# EAGLE design esp_console (EAGLE 9.2.1)
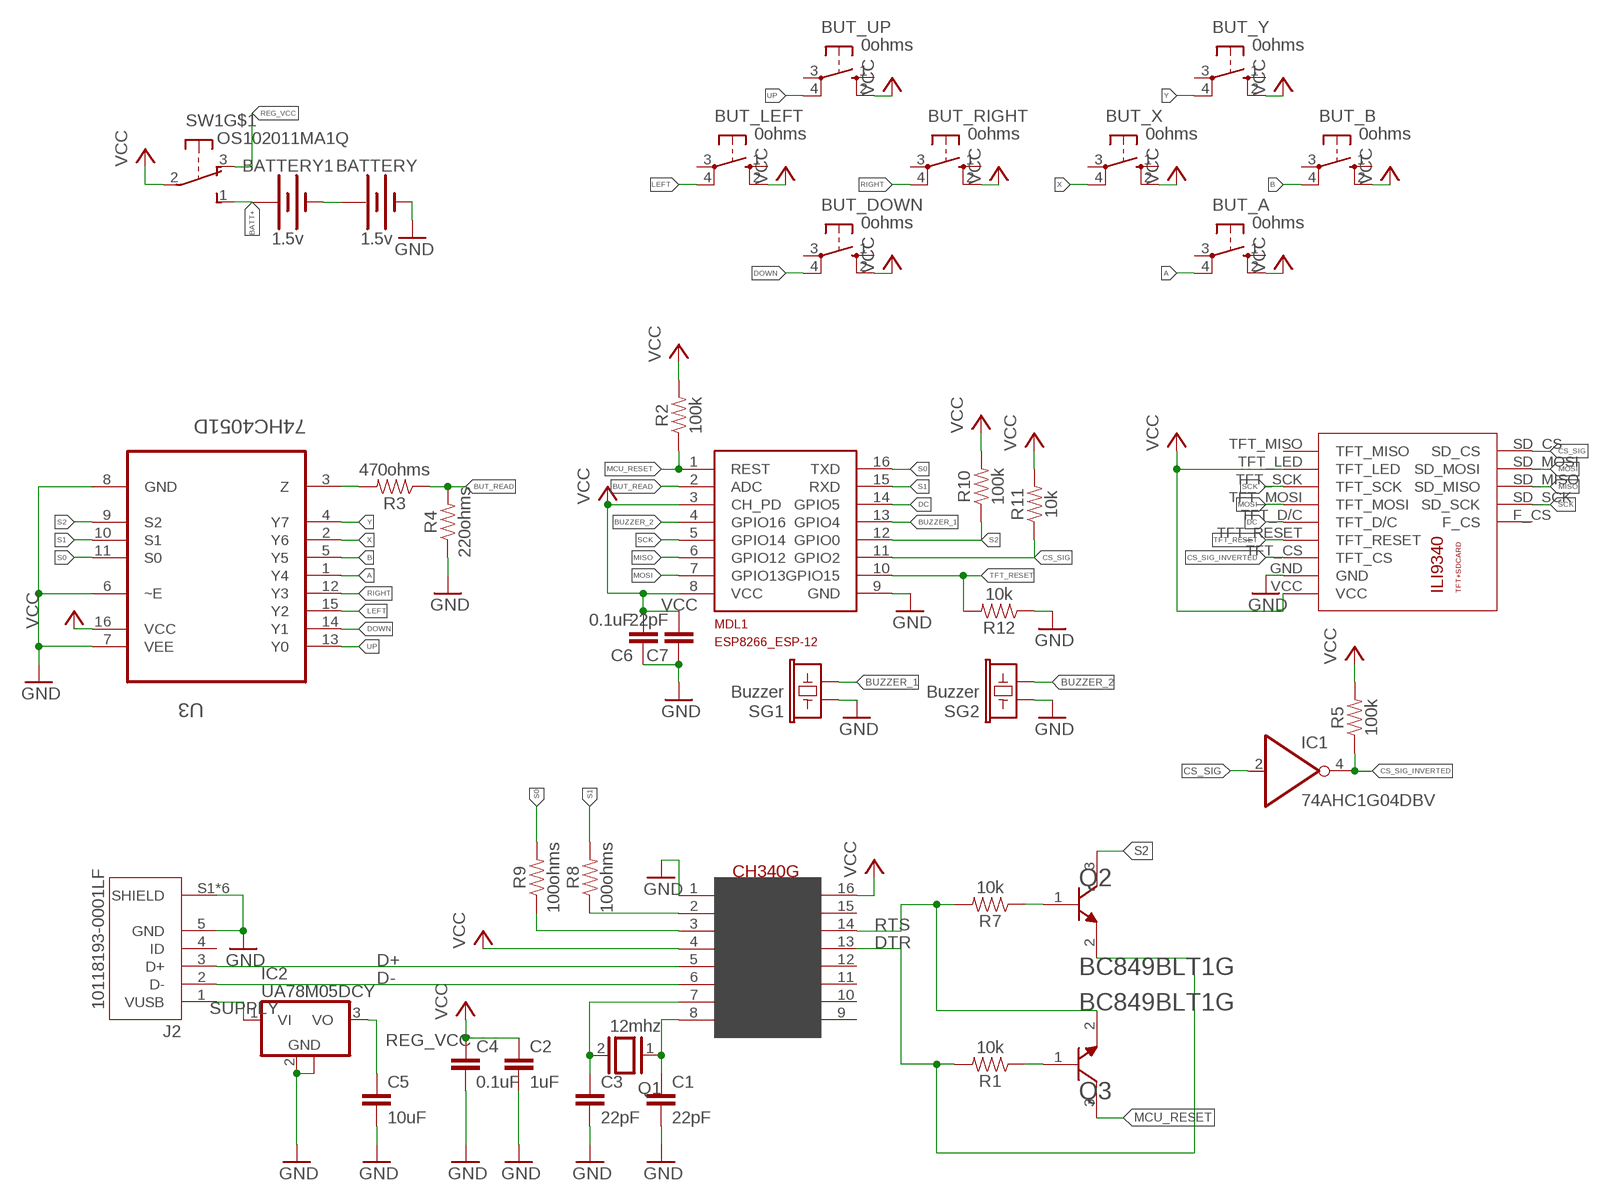
[diagram p0: schematic, sheet 1]

## Parts
BATTERY  1.5v  BATTERY-AA  [BATTERY-AA]
BATTERY1  1.5v  BATTERY-AA  [BATTERY-AA]
BUT_A  0ohms  10-XX  [B3F-10XX]
BUT_B  0ohms  10-XX  [B3F-10XX]
BUT_DOWN  0ohms  10-XX  [B3F-10XX]
BUT_LEFT  0ohms  10-XX  [B3F-10XX]
BUT_RIGHT  0ohms  10-XX  [B3F-10XX]
BUT_UP  0ohms  10-XX  [B3F-10XX]
BUT_X  0ohms  10-XX  [B3F-10XX]
BUT_Y  0ohms  10-XX  [B3F-10XX]
C1  22pF  C-EUC0603  [C0603]
C2  1uF  C-EUC0603  [C0603]
C3  22pF  C-EUC0603  [C0603]
C4  0.1uF  C-EUC0603  [C0603]
C5  10uF  C-EUC0603  [C0603]
C6  0.1uF  C-EUC0603  [C0603]
C7  22pF  C-EUC0603  [C0603]
IC1  74AHC1G04DBV  [SOT23-5]
IC2  UA78M05DCY  [SOT223]
J2  10118193-0001LF  [FCI_10118193-0001LF]
MDL1  MCU  ESP8266-12GPIO04/05_CORRECTED  [ESP8266-ESP12]
Q1  12mhz  XTAL/S  [QS]
Q2  ON_SEMICONDUCTOR_BC849BLT1GON_SEMICONDUCTOR_BC849BLT1G_0_0  [ON_SEMICONDUCTOR_BC849BLT1G_0]
Q3  ON_SEMICONDUCTOR_BC849BLT1GON_SEMICONDUCTOR_BC849BLT1G_0_0  [ON_SEMICONDUCTOR_BC849BLT1G_0]
R1  10k  10KOHM-0603-1/10W-1%  [0603]
R2  100k  10KOHM-0603-1/10W-1%  [0603]
R3  470ohms  10KOHM-0603-1/10W-1%  [0603]
R4  220ohms  10KOHM-0603-1/10W-1%  [0603]
R5  100k  10KOHM-0603-1/10W-1%  [0603]
R7  10k  10KOHM-0603-1/10W-1%  [0603]
R8  100ohms  10KOHM-0603-1/10W-1%  [0603]
R9  100ohms  10KOHM-0603-1/10W-1%  [0603]
R10  100k  10KOHM-0603-1/10W-1%  [0603]
R11  10k  10KOHM-0603-1/10W-1%  [0603]
R12  10k  10KOHM-0603-1/10W-1%  [0603]
SG1  Buzzer  BUZZERSMD2  [BUZZER-CCV]
SG2  Buzzer  BUZZERSMD2  [BUZZER-CCV]
SW1  OS102011MA1Q  [OS102011MA1Q]
U3  74HC4051D  [SOIC127P600X175-16N]
U$1  CH340G  [SOIC16]
U$2  ILI9340-5PIN  [ILI9340-5PIN]

## Nets
A: BUT_A.4(P1) U3.1(Y4)
B: BUT_B.4(P1) U3.5(Y5)
BATT+: BATTERY1.PWR@1(+) SW1.1(S)
BATT_LINK: BATTERY1.GND@1(-) BATTERY.PWR@1(+)
BUT_READ: MDL1.2(ADC) R3.1 R4.2
BUT_READ_3V3: R3.2 U3.3(Z)
BUZZER_1: MDL1.13(GPIO4) SG1.-
BUZZER_2: MDL1.4(GPIO16) SG2.-
CRYSTALIN: C3.1 Q1.2 U$1.7(XI)
CRYSTALOUT: C1.1 Q1.1 U$1.8(XO)
CS_SIG: IC1.2(I) MDL1.11(GPIO2) R11.1 U$2.SD_CS
CS_SIG_INVERTED: IC1.4(O) R5.1 U$2.TFT_CS
D+: J2.3(D+) U$1.5(D+)
D-: J2.2(D-) U$1.6(D-)
DC: MDL1.14(GPIO5) U$2.TFT_D/C
DOWN: BUT_DOWN.4(P1) U3.14(Y1)
DTR: Q2.2(E) R1.2 U$1.13(DTR)
GND: BATTERY.GND@1(-) C1.2 C2.2 C3.2 C4.2 C5.2 C6.1 C7.1 IC2.2(GND) IC2.4(GND) J2.5(GND) J2.S1(SHIELD) J2.S2(SHIELD) J2.S3(SHIELD) J2.S4(SHIELD) J2.S5(SHIELD) J2.S6(SHIELD) MDL1.9(GND) R4.1 R12.1 SG1.+ SG2.+ U3.6(~E) U3.7(VEE) U3.8(GND) U$1.1(GND) U$2.GND
LEFT: BUT_LEFT.4(P1) U3.15(Y2)
MCU_RESET: MDL1.1(REST) Q3.3(C) R2.1
MISO: MDL1.6(GPIO12) U$2.SD_MISO
MOSI: MDL1.7(GPIO13) U$2.SD_MOSI U$2.TFT_MOSI
N$3: Q3.1(B) R1.1
N$4: Q2.1(B) R7.1
REG_VCC: C5.1 IC2.3(VO) SW1.3(O)
RIGHT: BUT_RIGHT.4(P1) U3.12(Y3)
RTS: Q3.2(E) R7.2 U$1.14(RTS)
S0: MDL1.16(TXD) R9.2 U3.11(S0)
S1: MDL1.15(RXD) R8.2 U3.10(S1)
S2: MDL1.12(GPIO0) Q2.3(C) R10.1 U3.9(S2)
SCK: MDL1.5(GPIO14) U$2.SD_SCK U$2.TFT_SCK
SUPPLY: IC2.1(VI) J2.1(VUSB)
TFT_RESET: MDL1.10(GPIO15) R12.2 U$2.TFT_RESET
TXFROMMCU: R9.1 U$1.3(RX)
TXFROMPROGRAMMER: R8.1 U$1.2(TX)
UP: BUT_UP.4(P1) U3.13(Y0)
VCC: BUT_A.2(S1) BUT_B.2(S1) BUT_DOWN.2(S1) BUT_LEFT.2(S1) BUT_RIGHT.2(S1) BUT_UP.2(S1) BUT_X.2(S1) BUT_Y.2(S1) C2.1 C4.1 C6.2 C7.2 MDL1.3(CH_PD) MDL1.8(VCC) R2.2 R5.2 R10.2 R11.2 SW1.2(P) U3.16(VCC) U$1.4(V3) U$1.16(VCC) U$2.TFT_LED U$2.VCC
X: BUT_X.4(P1) U3.2(Y6)
Y: BUT_Y.4(P1) U3.4(Y7)
Unconnected: BUT_A.1(S) BUT_A.3(P) BUT_B.1(S) BUT_B.3(P) BUT_DOWN.1(S) BUT_DOWN.3(P) BUT_LEFT.1(S) BUT_LEFT.3(P) BUT_RIGHT.1(S) BUT_RIGHT.3(P) BUT_UP.1(S) BUT_UP.3(P) BUT_X.1(S) BUT_X.3(P) BUT_Y.1(S) BUT_Y.3(P) J2.4(ID) SW1.MT1(MT) SW1.MT2(MT) U$1.9(CTS) U$1.10(DSR) U$1.11(RI) U$1.12(DCD) U$1.15(RS232) U$2.F_CS U$2.TFT_MISO

## Power pins joined to a net without a drawn wire
GND: IC1.3(GND)
VCC: IC1.5(VCC)

## Library data of the parts
BATTERY BATTERY1 = SparkFun-Batteries:BATTERY: Battery - Single Cell A variety of battery chemistries, sizes, and footprints. Device List: 20MM_PTH - Coin Cell Battery Holder - 20mm (PTH) <https://www.sparkfun.com/products/783> 6.8MM_PTH - Coin Cell Battery Holder - 6.8MM(SMD) <https://www.digikey.com/product-detail/en/seiko-instruments/MS621FE-FL11E/728-1057-ND/1889208?WT.srch=1&gclid=CNOQ5a6LzdQCFZS2wAodXCkE0g> 12MM_SMD - Coin Cell Battery Holder - 12mm (SMD) <https://www.sparkfun.com/products/10592> 12MM_PTH - Coin Cell Battery Holder - 12mm (PTH) <https://www.sparkfun.com/products/7948> 20MM_SMD - 20mm Coin Cell Battery Holder (SMD) (2 legs) Used on the Big Time Watch Kit <https://www.sparkfun.com/products/11734> 20MM_SMD_4LEGS - Coin Cell Battery Holder - 20mm (SMD) <https://www.sparkfun.com/products/11892> 20MM_SMD_4LEGS_OVERPASTE - Coin Cell Battery Holder - 20mm (SMD) <https://www.sparkfun.com/products/11892> (Over-paste on the legs) 24.5MM_PTH - Coin Cell Battery Holder - 24.5mm (PTH) <https://www.sparkfun.com/products/8863> 9V - 9V Battery Holder - PC Mount Used on the SparkFun SparkPunk Sound Kit <https://www.sparkfun.com/products/11177> and SparkFun SparkPunk Sequencer Kit <https://www.sparkfun.com/products/12707> 18650 - Battery Holder - 18650 (PTH) <https://www.sparkfun.com/products/13113> AA - Battery Holder - 1xAA (PTH) <https://www.sparkfun.com/products/7949> AAA - Battery Holder - 1xAAA (PTH) <https://www.sparkfun.com/products/12718> AA_KIT - Battery Holder - 1xAA (PTH) <https://www.sparkfun.com/products/7949> Special kit package - pads only have exposed copper on one side of the board. AAA_KIT - Battery Holder - 1xAAA (PTH) <https://www.sparkfun.com/products/12718> Special kit package - pads only have exposed copper on one side of the board.; PROD_ID: BATT-08316; SF_SKU: PRT-07949
BUT_A BUT_B BUT_DOWN BUT_LEFT BUT_RIGHT BUT_UP BUT_X BUT_Y = switch-omron:10-XX: OMRON SWITCH; MPN: B3F-1000; OC_FARNELL: 176432; OC_NEWARK: 36M3542
C1-C7 = rcl:C-EU: CAPACITOR, European symbol; SPICEPREFIX: C
IC1 = 74xx-little-de:74*1G04: INVERTER Gate
IC2 = linear:UA78M*: POSITIVE-VOLTAGE REGULATORS Source: http://focus.ti.com/lit/ds/symlink/ua78m33.pdf
J2 = 10118193-0001LF:10118193-0001LF: Micro USB B Type Receptacle; AVAILABILITY: Unavailable; DESCRIPTION: Single Port 5 Contact Shielded SMT MICRO USB B-Type Receptacle; MF: Amphenol FCI; MP: 10118193-0001LF; PACKAGE: None; PRICE: None
MDL1 = ESP8266-ESP12:ESP8266-12: Espressif ESP8266 ESP-12 Module with GPIO04 and GPIO05 corrected.
Q1 = special:XTAL/S: CRYSTAL
Q2 Q3 = On Semiconductor - BC849BLT1G:ON_SEMICONDUCTOR_BC849BLT1G: ONSC-NPN-B1E2C3-3; CIIVA_IDS: 19369299; COMPONENT_LINK_1_DESCRIPTION: Manufacturer URL; COMPONENT_LINK_1_URL: http://www.onsemi.com/; COMPONENT_LINK_3_DESCRIPTION: Package Specification; COMPONENT_LINK_3_URL: http://www.onsemi.cn/pub_link/Collateral/318-08.PDF; DATASHEET: http://www.onsemi.cn/pub_link/Collateral/BC846ALT1-D.PDF; DATASHEET_VERSION: Rev. 11; FOOTPRINT_VARIANT_NAME_0: Manufacturer Recommended; FT_MIN_MHZ: 100; IC_CONTINUOUS_A: 0.1; IMPORTED: yes; IMPORTED_FROM: vault; IMPORT_TS: 1521843736; MF: On Semiconductor; MOUNTING_TECHNOLOGY: Surface Mount; MPN: BC849BLT1G; PACKAGE: SOT-23-3-318-08; PACKAGE_DESCRIPTION: 3-Pin Small Outline Transistor, Body 2.92 x 1.3 mm, Pitch 0.95 mm; PACKAGE_VERSION: Rev. AP, 11/2009; PACKING: Tape and Reel; POLARITY: NPN; PREFIX: Q; RELEASE_DATE: 1406898388; ROHS: Yes; VAULT_GUID: 19D3C7D6-08FD-4A81-9BD4-62C7617130FB; VAULT_REVISION: B4675A61-FAF7-4072-9C56-0A9635A35669
R1 R7 R11 R12 = SparkFun-Resistors:10KOHM: 10kΩ resistor A resistor is a passive two-terminal electrical component that implements electrical resistance as a circuit element. Resistors act to reduce current flow, and, at the same time, act to lower voltage levels within circuits. - Wikipedia; PROD_ID: RES-00824
R2-R5 R8-R10 = SparkFun-Resistors:10KOHM: 10kΩ resistor A resistor is a passive two-terminal electrical component that implements electrical resistance as a circuit element. Resistors act to reduce current flow, and, at the same time, act to lower voltage levels within circuits. - Wikipedia; PROD_ID: RES-00824; VALUE: 10k
SG1 SG2 = ThingMagic_Module:BUZZER: Buzzer 12mm Spark Fun Electronics SKU : Comp-Buzzer; PROD_ID: COMP-08568
SW1 = adafruit:OS102011MA1Q: OS10201MA1Q through-hole right angle switch http://www.ladyada.net/library/eagle
U3 = 74HC4051D:74HC4051D: 8-channel analog multiplexer/demultiplexer; MPN: 74HC4051D; OC_FARNELL: 1201327; OC_NEWARK: -; PACKAGE: SOIC-16; SUPPLIER: NXP
U$1 = ch340g:CH340G
U$2 = ili9340:ILI9340-5PIN

## Board
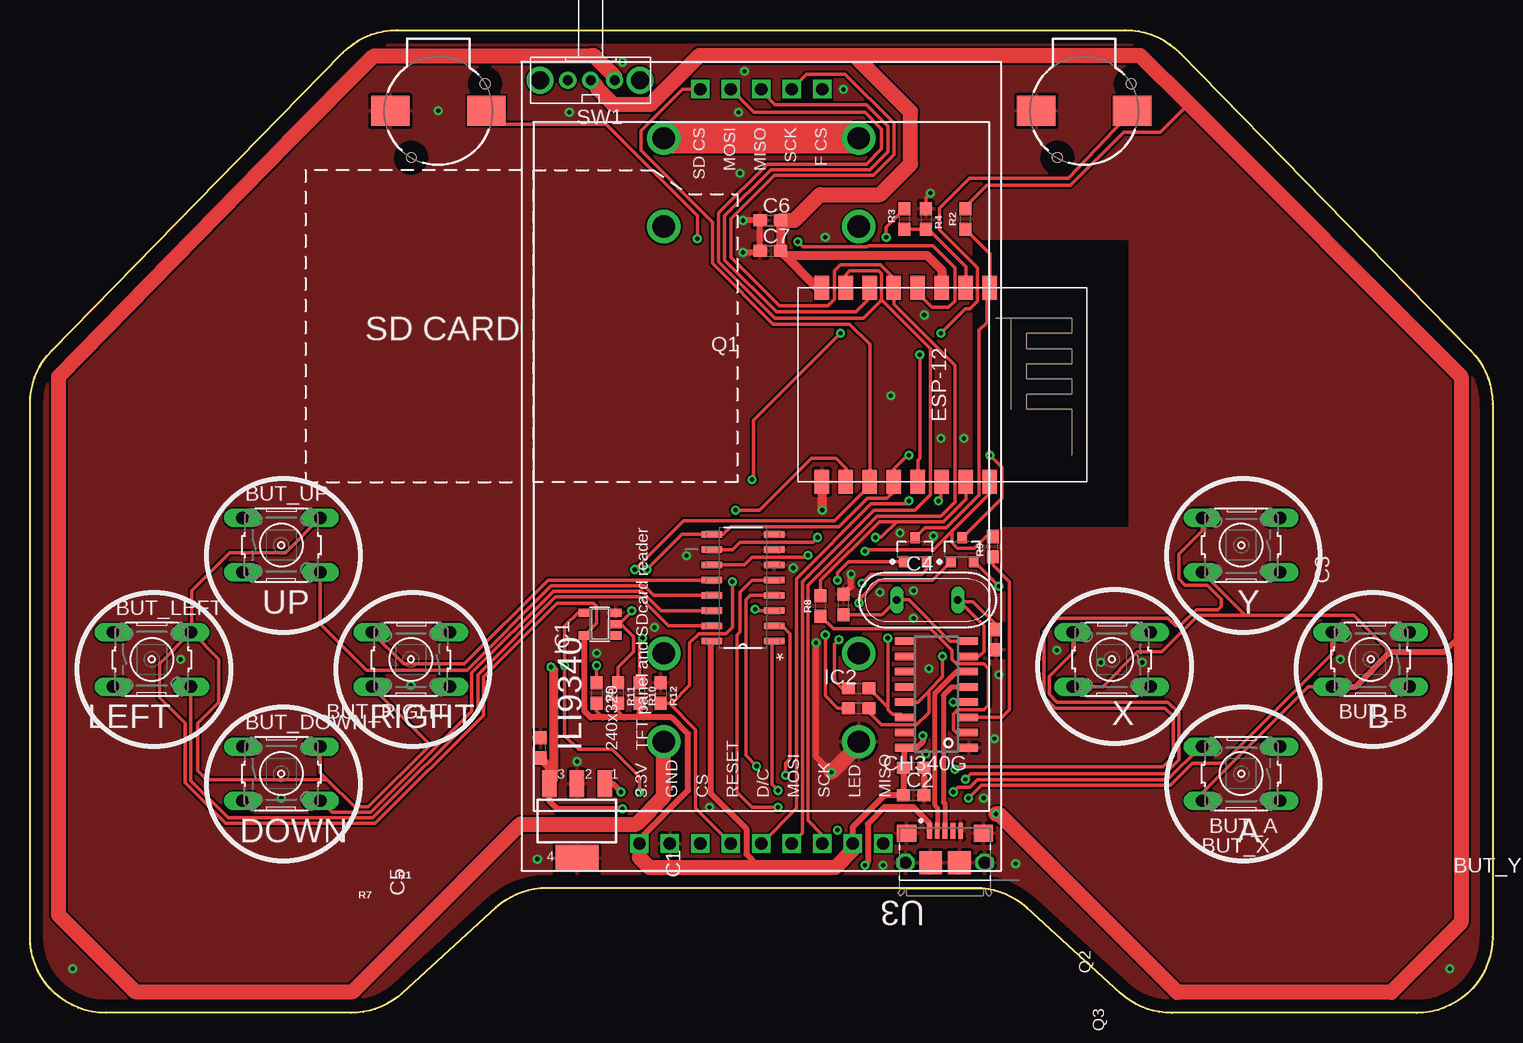
[diagram p1: board, top side]
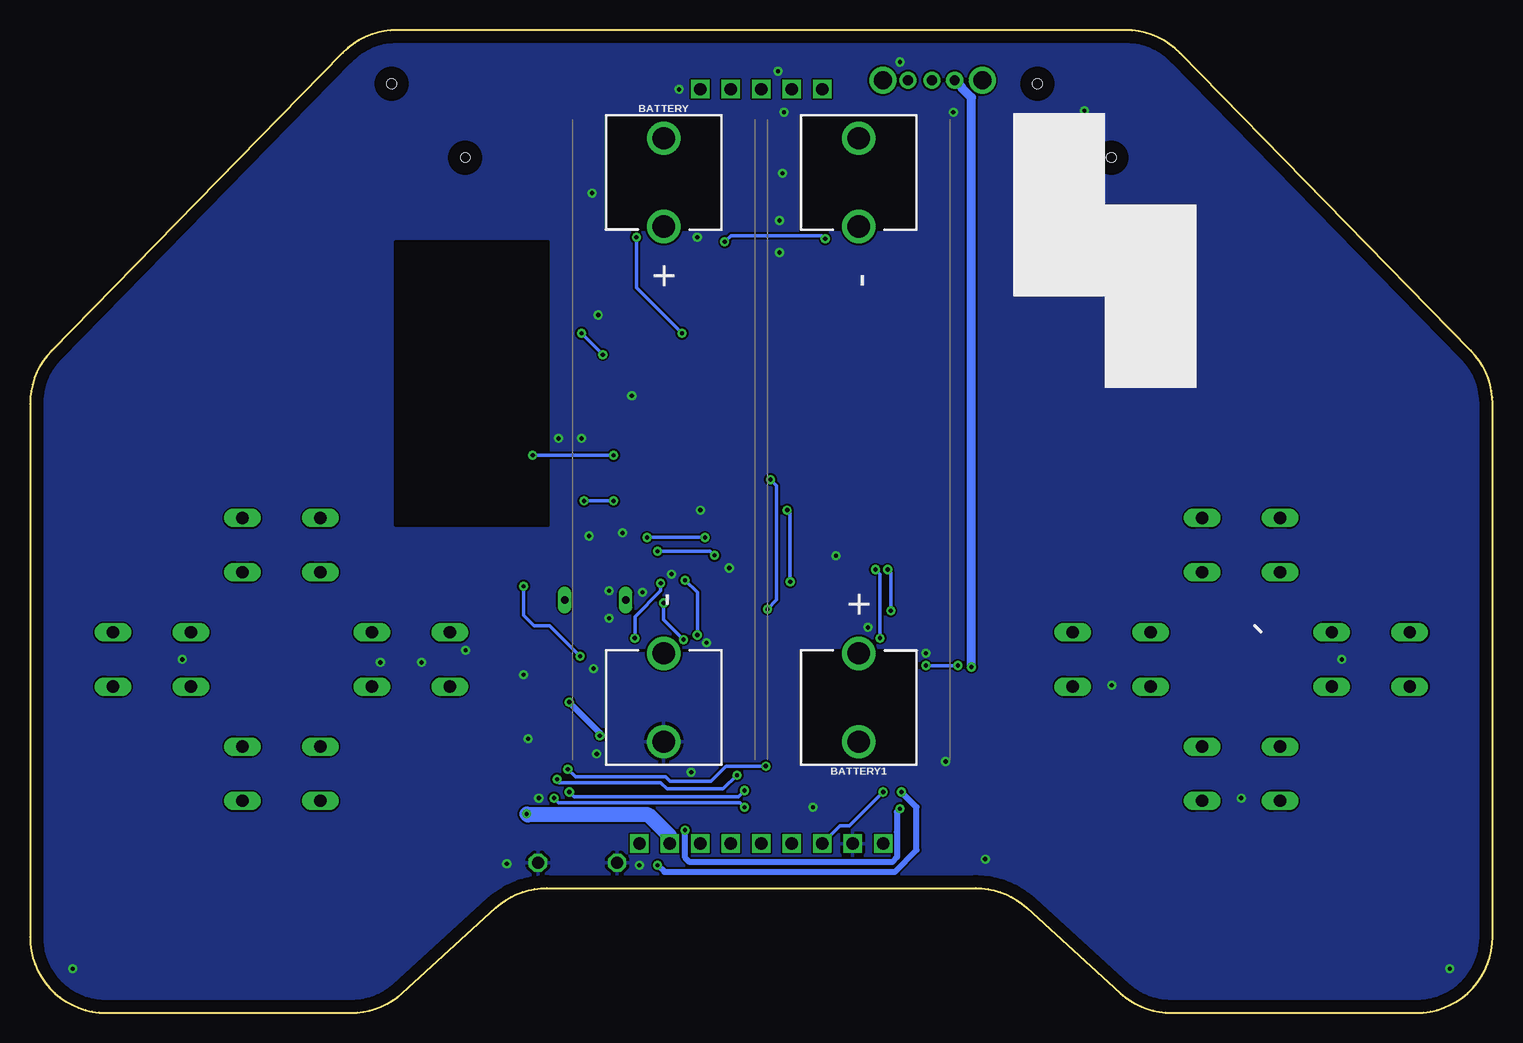
[diagram p2: board, bottom side, seen from below]

Size 121.92 x 81.91 mm. Coordinates in mm from the lower left corner, seen from the top.
Outline: 0,6.35 0,50.75 arc-44 1.81,55.19 26.07,80 arc-46 30.61,81.91 91.31,81.91 arc-46 95.85,80 120.11,55.19 arc-44 121.92,50.75 121.92,6.35 arc-90 115.57,0 95.17,0 arc-42 90.89,1.66 83.1,8.76 arc42 78.82,10.41 43.1,10.41 arc42 38.82,8.76 31.03,1.66 arc-42 26.75,0 6.35,0 arc-90 0,6.35
Copper layers (1*16): Top 0.035mm / dielectric 1.5mm / Bottom 0.035mm
Design rules "default": minimum track width 6mil, minimum drill 0.35mm, track to track 6mil, track to pad 6mil, pad to pad 6mil, via to via 6mil, smd to smd 6mil, copper to edge 40mil, drill to drill 6mil, minimum pad ring 10mil, minimum via ring 8mil, stop-mask expansion 4mil, vias tented up to drill 0mil, thermal gap 10mil

### Footprints (pad centres in the part's own frame; a part is rotated, then mirrored left to right if it is on the bottom)
BATTERY-AA = drill 1.854: GND@1 25.146,0; GND@2 17.78,0; PWR@1 -25.146,0; PWR@2 -17.78,0
B3F-10XX = drill 1.016 long: 1 -3.251,2.261; 2 3.251,2.261; 3 -3.251,-2.261; 4 3.251,-2.261
C0603 = smd 1.1 x 1: 1 -0.85,0; 2 0.85,0
SOT23-5 = smd 0.69 x 0.99: 1 -0.95,-1.29; 2 0,-1.29; 3 0.95,-1.29; 4 0.95,1.3; 5 -0.95,1.3
SOT223 = smd 1.219 x 2.235: 1 -2.311,-3.099; 2 0,-3.099; 3 2.311,-3.099 | smd 3.6 x 2.2: 4 0,3.099
FCI_10118193-0001LF = smd 0.4 x 1.35: 1 -1.3,2.675; 2 -0.65,2.675; 3 0,2.675; 4 0.65,2.675; 5 1.3,2.675 | smd 1.6 x 1.4: S1 -3.2,2.45; S2 3.2,2.45 | smd 1.9 x 1.9: S3 1.2,0; S4 -1.2,0 | drill 1.016 pad 1.27 octagon: S5 -3.3,0; S6 3.3,0
ESP8266-ESP12 = smd 2 x 1.2: 1 0,16; 2 0,14; 3 0,12; 4 0,10; 5 0,8; 6 0,6; 7 0,4; 8 0,2; 9 16.2,2; 10 16.2,4; 11 16.2,6; 12 16.2,8; 13 16.2,10; 14 16.2,12; 15 16.2,14; 16 16.2,16
QS = drill 0.61 long: 1 -2.54,0; 2 2.54,0
ON_SEMICONDUCTOR_BC849BLT1G_0 = smd 0.9 x 0.8: 1 -1,0.95; 2 -1,-0.95; 3 1,0
0603 = smd 1.1 x 1: 1 -0.85,0; 2 0.85,0
BUZZER-CCV = smd 3.2 x 2.5: + 4,0; - -4,0 | hole 0.8: -3.9,-2.25; 2.25,3.9
OS102011MA1Q = drill 0.8 pad 1.422: 1 -2,0; 2 0,0; 3 1.9,0 | drill 1.5 pad 2.184: MT1 -4.1,0; MT2 4.2,0
SOIC127P600X175-16N = smd 1.702 x 0.533: 1 -2.591,4.445; 2 -2.591,3.175; 3 -2.591,1.905; 4 -2.591,0.635; 5 -2.591,-0.635; 6 -2.591,-1.905; 7 -2.591,-3.175; 8 -2.591,-4.445; 9 2.591,-4.445; 10 2.591,-3.175; 11 2.591,-1.905; 12 2.591,-0.635; 13 2.591,0.635; 14 2.591,1.905; 15 2.591,3.175; 16 2.591,4.445
SOIC16 = smd 0.635 x 1.524: 1 -4.445,-2.695; 2 -3.175,-2.695; 3 -1.905,-2.695; 4 -0.635,-2.695; 5 0.635,-2.695; 6 1.905,-2.695; 7 3.175,-2.695; 8 4.445,-2.695; 9 4.445,2.695; 10 3.175,2.695; 11 1.905,2.695; 12 0.635,2.695; 13 -0.635,2.695; 14 -1.905,2.695; 15 -3.175,2.695; 16 -4.445,2.695
ILI9340-5PIN = drill 1.016 square: F_CS 5.08,31.115; GND -7.62,-31.75; SD_CS -5.08,31.115; SD_MISO 0,31.115; SD_MOSI -2.54,31.115; SD_SCK 2.54,31.115; TFT_CS -5.08,-31.75; TFT_D/C 0,-31.75; TFT_LED 7.62,-31.75; TFT_MISO 10.16,-31.75; TFT_MOSI 2.54,-31.75; TFT_RESET -2.54,-31.75; TFT_SCK 5.08,-31.75; VCC -10.16,-31.75

### Placement (x,y rotation side)
BATTERY  69.09,47.75 270 bottom
BATTERY1  52.83,47.75 90 bottom
BUT_A  100.97,19.94 180 top
BUT_B  111.76,29.46 180 top
BUT_DOWN  20.95,19.94 0 top
BUT_LEFT  10.16,29.46 0 top
BUT_RIGHT  31.75,29.46 180 top
BUT_UP  20.95,38.99 0 top
BUT_X  90.17,29.46 180 top
BUT_Y  100.97,38.99 180 top
C1  67.82,34.04 90 top
C2  73.66,18.16 0 top
C3  80.52,31.11 270 top
C4  73.66,20.45 0 top
C5  42.55,22.1 90 top
C6  61.72,66.04 0 top
C7  61.72,63.5 0 top
IC1  47.51,32.4 90 top
IC2  45.59,16 180 top
J2  76.28,12.52 0 top
MDL1  64.01,60.45 270 top
Q1  74.8,34.42 0 top
Q2  77.72,38.61 90 top
Q3  73.79,38.61 90 top
R1  69.09,25.4 0 top
R2  77.98,66.17 90 top
R3  72.9,66.17 90 top
R4  74.68,66.17 270 top
R5  47.24,26.67 270 top
R7  69.09,27.05 0 top
R8  65.91,33.91 90 top
R9  80.26,38.86 90 top
R10  50.8,26.67 270 top
R11  49.02,26.67 270 top
R12  52.58,26.67 270 top
SG1  87.88,75.18 180 top
SG2  34.04,75.18 180 top
SW1  46.74,77.72 180 top
U3  59.44,35.43 180 top
U$1  75.56,26.54 90 top
U$2  60.96,45.87 0 top

### Tracks (layer width: path | path; a pad name or v marks a point on that pad's centre or on a via)
A  (via drill 0.35)
  Top 0.305: BUT_A.4 97.59,22.2 94.82,19.43 78.99,19.43 78.36,18.8 77.34,18.8 v76.96,18.41 | v62.36,18.54 61.85,19.05 61.85,30.81 U3.1
  Bottom 0.305: v76.96,18.41 76.58,18.03 62.87,18.03 v62.36,18.54
B  (via drill 0.35)
  Top 0.305: BUT_B.4 108.51,29.9 99.44,20.83 96.9,20.83 95.05,18.97 79.3,18.97 v78.23,17.91 | v62.36,17.14 60.2,17.14 58.93,18.41 58.93,31.5 59.18,31.75 59.18,35.05 60.2,36.07 U3.5
  Bottom 0.305: v78.23,17.91 77.85,17.53 62.74,17.53 v62.36,17.14
BATT+
  Top 1.27: SW1.1 48.74,78.06 46.99,79.81 46.79,79.81 46.75,79.77 28.74,79.77 28.62,79.72 21.42,72.51 2.36,53.02 2.36,8.18 8.76,1.78 26.9,1.78 40.87,15.75 50.55,15.75 52.83,18.03 BATTERY1.PWR@1
BATT_LINK
  Top 2.54: BATTERY1.GND@1 BATTERY.PWR@1
BUT_READ
  Top 0.305: MDL1.2 78.01,62.2 74.89,65.32 R4.2 R3.1
BUT_READ_3V3  (via drill 0.35)
  Top 0.305: v67.56,56.64 60.33,49.4 60.33,44.58 v60.2,44.45 | v71.37,64.64 71.37,65.49 R3.2 | v60.45,33.66 60.58,33.53 U3.3
  Bottom 0.305: v67.56,56.64 71.37,60.45 v71.37,64.64 | v60.2,44.45 59.69,43.94 59.69,34.42 v60.45,33.66
BUZZER_1  (via drill 0.35)
  Top 0.305: MDL1.13 74.01,46.07 74.17,46.23 v74.17,54.86 | v75.95,56.64 77.98,58.67 78.36,58.67 78.99,59.31 78.99,62.1 75.82,65.28 75.82,67.06 78.31,69.55 86.56,69.55 86.61,69.6 SG1.-
  Bottom 0.305: v74.17,54.86 v75.95,56.64
BUZZER_2  (via drill 0.35)
  Top 0.305: MDL1.4 74.01,59.98 75.18,58.8 76.58,58.8 77.09,59.31 77.09,62.1 75.26,63.93 69.89,63.93 69.79,63.84 64.43,63.84 v64.01,64.26 | v55.63,64.52 55.63,66.42 48.01,74.04 39.18,74.04 SG2.-
  Bottom 0.305: v64.01,64.26 63.5,64.77 55.88,64.77 v55.63,64.52
CRYSTALIN
  Top 0.305: U$1.7 79.12,29.72 79.5,30.1 79.5,32.26 Q1.2 77.47,34.29 78.61,34.29 80.52,32.39 C3.1
CRYSTALOUT
  Top 0.305: U$1.8 76.71,30.99 73.28,34.42 Q1.1 71.03,33.19 C1.1
CS_SIG  (via drill 0.35)
  Top 0.305: R11.1 49.02,28.83 50.29,30.1 50.29,31.37 49.26,32.4 49.12,32.4 | U$2.SD_CS 54.38,76.99 50.93,73.53 50.93,71.88 56.9,65.91 56.9,62.46 61.95,57.4 68.33,57.4 70.01,55.72 MDL1.11 70.01,43.97 67.06,41.02 54.48,41.02 v50.42,36.96 | 49.12,32.4 IC1.2 | v50.16,33.53 50.16,33.44 49.12,32.4
  Bottom 0.305: v50.42,36.96 50.16,36.7 v50.16,33.53
CS_SIG_INVERTED  (via drill 0.35)
  Top 0.305: IC1.4 45.67,33.35 44.58,32.26 v44.58,28.96 44.58,23.11 45.72,21.97 48.51,21.97 50.8,19.69 v50.8,18.41 | R5.1 v47.24,28.96
  Bottom 0.305: v50.8,18.41 53.59,15.62 54.38,15.62 U$2.TFT_CS | v47.24,28.96 v44.58,28.96
D+
  Top 0.406: U$1.5 76.83,27.18 76.13,26.48 76.13,17.59 76.28,17.45 J2.3
D-
  Top 0.406: U$1.6 77.24,28.45 75.44,26.65 75.44,17.27 75.63,17.08 J2.2
DC  (via drill 0.35)
  Top 0.305: MDL1.14 75.95,44.19 75.95,42.88 v75.74,42.67 | U$2.TFT_D/C 63.88,17.04 63.88,36.18 70.12,42.42 73.03,42.42 v73.28,42.67
  Bottom 0.305: v73.28,42.67 v75.74,42.67
DOWN
  Top 0.305: U3.14 52.59,33.53 50.99,35.13 43.63,35.13 36.83,28.33 36.83,25.16 28.39,16.71 25.17,16.71 BUT_DOWN.4
DTR  (via drill 0.35)
  Top 0.305: U$1.13 74.04,25.91 74.93,26.8 | v80.77,35.56 78.72,37.61 Q2.2 | R1.2 69.94,25.06 70.99,24 73.91,24 74.93,25.02 74.93,26.8 | v76.07,29.72 76.07,28 74.93,26.86 74.93,26.8
  Bottom 0.305: v76.07,29.72 78.61,32.26 79.88,32.26 80.77,33.15 v80.77,35.56
GND  (via drill 0.35)
  Top 0.305: C7.1 60.74,63.37 | R4.1 74.68,67.94 v75.06,68.33
  Top 0.508: C7.1 C6.1 v59.44,66.04 | 60.74,63.37 v59.44,63.37 | C1.2 68.45,35.52 v68.45,36.58 | C4.2 C2.2 | v66.8,20.07 65.53,21.34 v65.53,30.86
  Top 0.762: MDL1.9 66.04,44.25 v66.04,41.91
  Top 1.27: BATTERY.GND@1 69.09,22.35 v66.8,20.07
  other vias: 80.77,28.19 80.39,22.86 71.12,12.32 82.17,12.45 44.96,75.06 49.4,79.25 3.56,3.68 118.36,3.68 74.68,21.59 34.04,75.18 54.74,38.1 52.07,32.13 47.24,29.97 63.63,37.08 72.52,40 45.59,20.95 70.87,35.05 73.66,35.18 73.66,32.89 75.31,39.75 109.22,29.46 71.75,51.44 74.55,58.17 74.93,28.7 12.57,29.46 20.95,17.91 31.75,27.3 59.18,69.98 59.56,78.49 59.05,75.06 67.82,76.96 66.29,64.64 77.85,47.88 75.95,47.88 56.64,17.14 89.28,29.21 92.71,29.21 85.6,30.23 42.29,12.83 79.5,17.91
  pour Top: -1.27,83.82 123.19,83.82 123.19,-5.08 -1.27,-5.08
  pour Bottom: -1.27,83.82 123.19,83.82 123.19,-5.08 -1.27,-5.08
  cutout Bottom: 78.74,64.26 78.74,40.64 91.44,40.64 91.44,64.26
  cutout Top: 91.44,64.26 91.44,40.64 78.74,40.64 78.74,64.26
LEFT
  Top 0.305: U3.15 53.21,32.26 50.8,34.67 43.81,34.67 37.34,28.19 37.34,25.02 28.57,16.26 16.51,16.26 13.41,19.36 BUT_LEFT.4
MCU_RESET
  Top 0.305: R2.1 80.01,63.29 MDL1.1 79.76,60.2 79.76,57.53 79.1,56.88 79.1,43.16 76.38,40.44 74.62,40.44 Q3.3
MISO
  Top 0.305: U$2.SD_MISO 60.96,76.83 62.1,75.69 69.72,75.69 71.5,73.91 71.5,71.75 70.03,70.28 61.77,70.28 57.91,66.42 57.91,62.74 62.23,58.42 68.83,58.42 70.01,59.59 MDL1.6
MOSI
  Top 0.305: MDL1.7 68.01,61.53 68.33,61.85 70.74,61.85 70.99,61.59 70.99,59.42 | 70.99,59.42 75.06,55.36 75.06,43.18 73.79,41.91 70.36,41.91 64.39,35.94 64.39,15.01 U$2.TFT_MOSI | U$2.SD_MOSI 60.35,75.06 69.6,75.06 70.99,73.66 70.99,72.01 69.72,70.74 61.47,70.74 57.4,66.67 57.4,62.6 62.09,57.91 69.5,57.91 70.91,59.33 70.91,59.34 70.99,59.42
N$3  (via drill 0.35)
  Top 0.305: v67.31,36.07 67.31,36.7 68.22,37.61 Q3.1 | v66.29,31.5 66.29,26.42 67.31,25.4 R1.1
  Bottom 0.305: v67.31,36.07 66.29,35.05 v66.29,31.5
N$4  (via drill 0.35)
  Top 0.305: v67.44,31.11 67.06,30.73 67.06,27.69 67.69,27.05 R7.1 | Q2.1 75.24,36.08 70.75,36.08 69.09,34.42 v69.09,34.16
  Bottom 0.305: v69.09,34.16 69.09,32.77 v67.44,31.11
REG_VCC  (via drill 0.35)
  Top 0.508: IC2.3 43.28,17.68 43.94,17.02 v49.4,17.02
  Top 0.762: v43.43,28.83 43.66,28.6 43.66,19.48 IC2.3 43.28,20.51 C5.1
  Bottom 0.508: v49.4,17.02 49.66,16.76 49.66,15.08 49.63,15.05 49.63,12.98 50.04,12.57 66.93,12.57 67.31,12.95 v67.31,15.24
  Bottom 0.762: SW1.3 44.19,77.08 44.19,77.04 43.43,76.28 v43.43,28.83
RIGHT
  Top 0.305: U3.12 43.18,36.07 36.2,29.08 31.14,29.08 BUT_RIGHT.4
RTS  (via drill 0.35)
  Top 0.305: U$1.14 72.62,24.89 71.88,24.89 71.5,25.27 71.5,25.49 | v69.34,35.81 70.1,36.58 74.34,36.58 74.74,36.97 Q3.2 | 71.5,25.49 v71.5,31.24 | R7.2 71.5,25.49
  Bottom 0.305: v71.5,31.24 71.5,33.02 69.34,35.18 v69.34,35.81
S0  (via drill 0.35)
  Top 0.305: MDL1.16 80.01,43.31 76.83,40.13 | 76.83,40.13 75.31,38.61 69.72,38.61 v69.6,38.48 | R9.2 79.72,39.71 78.74,38.73 77.32,38.73 77.02,39.03 77.02,39.06 76.83,39.24 76.83,40.13 | v64.86,38.13 64.7,37.97 60.2,37.97 59.56,37.34 U3.11
  Bottom 0.305: v69.6,38.48 65.21,38.48 v64.86,38.13
S1  (via drill 0.35)
  Top 0.305: MDL1.15 78.01,42.82 76.14,40.95 72.26,40.95 | 72.26,40.95 70.8,40.95 65.91,36.06 R8.2 | 72.26,40.95 70.94,39.62 v70.48,39.62 | v65.66,39.62 65.28,39.24 59.18,39.24 58.55,38.61 U3.10
  Bottom 0.305: v70.48,39.62 v65.66,39.62
S2  (via drill 0.35)
  Top 0.305: Q2.3 81.03,42.91 81.03,45.47 v80.01,46.48 | v73.28,46.48 73.15,46.48 72.01,45.34 MDL1.12 72.01,43.43 71.45,42.88 69.8,42.88 67.44,40.51 58.42,40.51 57.78,39.88 U3.9 54.36,39.88 v51.44,36.96 | R10.1 50.8,30.99 v51.05,31.24
  Bottom 0.305: v80.01,46.48 v73.28,46.48 | v51.05,31.24 51.05,36.58 v51.44,36.96
SCK
  Top 0.305: U$2.TFT_SCK 66.04,14.87 64.85,16.06 64.85,35.64 70.61,41.4 75.95,41.4 77.09,42.55 77.09,53.97 72.01,59.06 MDL1.5 72.01,61.23 70.88,62.36 67.56,62.36 67.06,61.85 67.06,59.47 66.52,58.93 62.48,58.93 58.42,62.99 58.42,66.17 62.08,69.83 70.33,69.83 72.01,71.5 72.01,74.17 67.94,78.23 64.75,78.23 U$2.SD_SCK
SUPPLY  (via drill 0.35)
  Top 0.508: J2.1 74.98,15.81 73.64,17.14 71.25,17.14 69.85,15.75 69.85,12.57 v69.6,12.32 | v49.28,18.41 48.59,19.1 IC2.1
  Bottom 0.508: v69.6,12.32 69.04,11.76 49.84,11.76 48.01,13.59 48.01,17.14 v49.28,18.41
TFT_RESET  (via drill 0.35)
  Top 0.305: R12.2 53.3,25.82 | U$2.TFT_RESET 55.5,17.04 55.5,23.62 53.3,25.82 | MDL1.10 68.01,45.4 67.18,46.23 65.15,46.23 60.83,41.91 v58.8,41.91 | v58.55,35.94 58.55,32.13 58.04,31.62 55.75,31.62 54.99,30.86 54.99,27.3 53.51,25.82 53.3,25.82
  Bottom 0.305: v58.8,41.91 58.55,41.66 v58.55,35.94
TXFROMMCU
  Top 0.305: U$1.3 81.03,24.64 81.66,25.27 81.66,35.94 80.26,37.34 R9.1
TXFROMPROGRAMMER
  Top 0.305: U$1.2 77.22,23.37 76.96,23.62 76.96,24.89 77.33,25.26 79.53,25.26 79.91,25.64 79.91,28.69 79.52,29.08 77.22,29.08 76.83,29.46 76.83,30.21 75.05,32 66.97,32 R8.1
UP
  Top 0.305: U3.13 51.97,34.8 51.18,35.59 43.44,35.59 36.43,28.57 28.07,28.57 24.21,32.44 BUT_UP.4
VCC  (via drill 0.35)
  Top 0.305: BUT_UP.2 21.31,38.35 16.64,38.35 13.46,35.18 13.46,31.77 | 13.46,31.77 BUT_LEFT.2 10.79,29.11 10.79,26.29 12.95,24.13 12.95,19.16 16.32,15.8 28.76,15.8 37.8,24.83 37.8,28 43.95,34.16 46.99,34.16 47.24,33.91 47.24,32.48 IC1.5 | BUT_A.2 97.71,18.34 106.58,27.2 BUT_B.2 | R2.2 77.98,67.18 79.76,68.96 86.74,68.96 91.19,73.41 94.23,73.41 96.58,75.76 | 13.46,31.77 15.75,29.49 15.75,25.91 13.98,24.14 13.98,20.2 14.74,19.43 24.79,19.43 | BUT_RIGHT.2 33.27,22.43 33.27,22.25 28.2,17.17 27.05,17.17 24.79,19.43 | 24.79,19.43 24.21,20.02 BUT_DOWN.2 | 113.41,30.1 110.36,33.15 101.3,33.15 | 101.3,33.15 BUT_Y.2 | BUT_X.2 89.43,27.2 92.33,30.1 94.36,30.1 97.41,33.15 101.3,33.15 | R5.2 47.24,25.15 47.75,24.64 | R11.2 49.02,25.15 49.53,24.64
  Top 0.508: U$2.VCC 50.8,14.48 54.86,18.54 54.86,23.24 53.47,24.64 51.18,24.64 | 119.3,31.5 117.91,30.1 113.41,30.1 110.52,27.2 BUT_B.2 | IC1.5 46.23,31.43 46.23,25.15 46.74,24.64 47.75,24.64 49.53,24.64 51.18,24.64 | U3.16 56.77,30.91 56.77,18.29 59.72,15.34 59.72,13.27 60.71,12.28 60.71,12.14 | R10.2 50.8,25.02 51.18,24.64 | U$1.4 v76.96,25.91 | v74.42,23.11 74.42,22.61 73.91,22.1 U$1.16 72.87,20.51 C4.1 C2.1 71.25,18.16 68.58,15.49 U$2.TFT_LED
  Top 0.762: MDL1.3 76.01,61.91 74.8,63.12 62.95,63.12 C7.2 | C6.2 C7.2 | C7.2 65.62,60.45 MDL1.8
  Top 1.27: U$2.VCC 50.8,12.95 51.61,12.14 60.71,12.14 67.13,12.14 68.58,13.59 U$2.TFT_LED | SW1.2 47.24,77.22 47.24,77.1 48.65,75.69 51.69,75.69 55.8,79.81 68.71,79.81 | C6.2 63.72,66.04 65.87,68.2 70.87,68.2 73.41,70.74 73.41,75.11 68.71,79.81 | v80.52,16.59 80.77,16.59 95.63,1.73 113.49,1.73 119.3,7.54 119.3,31.5 119.3,53.03 96.58,75.76 92.53,79.81 68.71,79.81
  Bottom 0.508: v76.96,25.91 74.42,23.37 v74.42,23.11
  Bottom 1.27: U$2.TFT_LED 68.58,14.73 70.36,16.51 80.44,16.51 v80.52,16.59
X  (via drill 0.35)
  Top 0.305: v62.99,19.81 62.99,20.83 63.37,21.21 63.37,31.62 62.74,32.26 U3.2 | BUT_X.4 86.92,30.02 84.96,28.07 84.96,26.54 85.6,25.91 94.87,25.91 95.76,25.02 95.76,21.08 94.61,19.94 78.44,19.94 v77.98,19.48
  Bottom 0.305: v62.99,19.81 64.14,18.67 68.83,18.67 69.34,19.18 77.8,19.18 77.98,19.35 v77.98,19.48
Y  (via drill 0.35)
  Top 0.305: U3.4 60.07,34.8 59.69,34.42 59.69,21.46 v60.58,20.57 | v77.09,20.32 77.28,20.51 94.42,20.51 95.3,21.39 95.3,24.71 94.61,25.4 85.46,25.4 84.51,26.35 84.51,31.8 85.6,32.89 94.87,32.89 95.5,32.26 95.87,32.26 97.22,33.6 99.01,33.6 99.31,33.91 99.31,34.48 98.13,35.66 96.29,35.66 95.76,36.2 95.76,38.23 97.71,40.18 BUT_Y.4
  Bottom 0.305: v60.58,20.57 63.88,20.57 65.15,19.3 68.58,19.3 68.96,19.69 76.45,19.69 v77.09,20.32

### Text on the board
tPlace: UP | Y | LEFT | RIGHT | X | B | DOWN | A